# Altium project AC_Measurev2_250616.PrjPcb
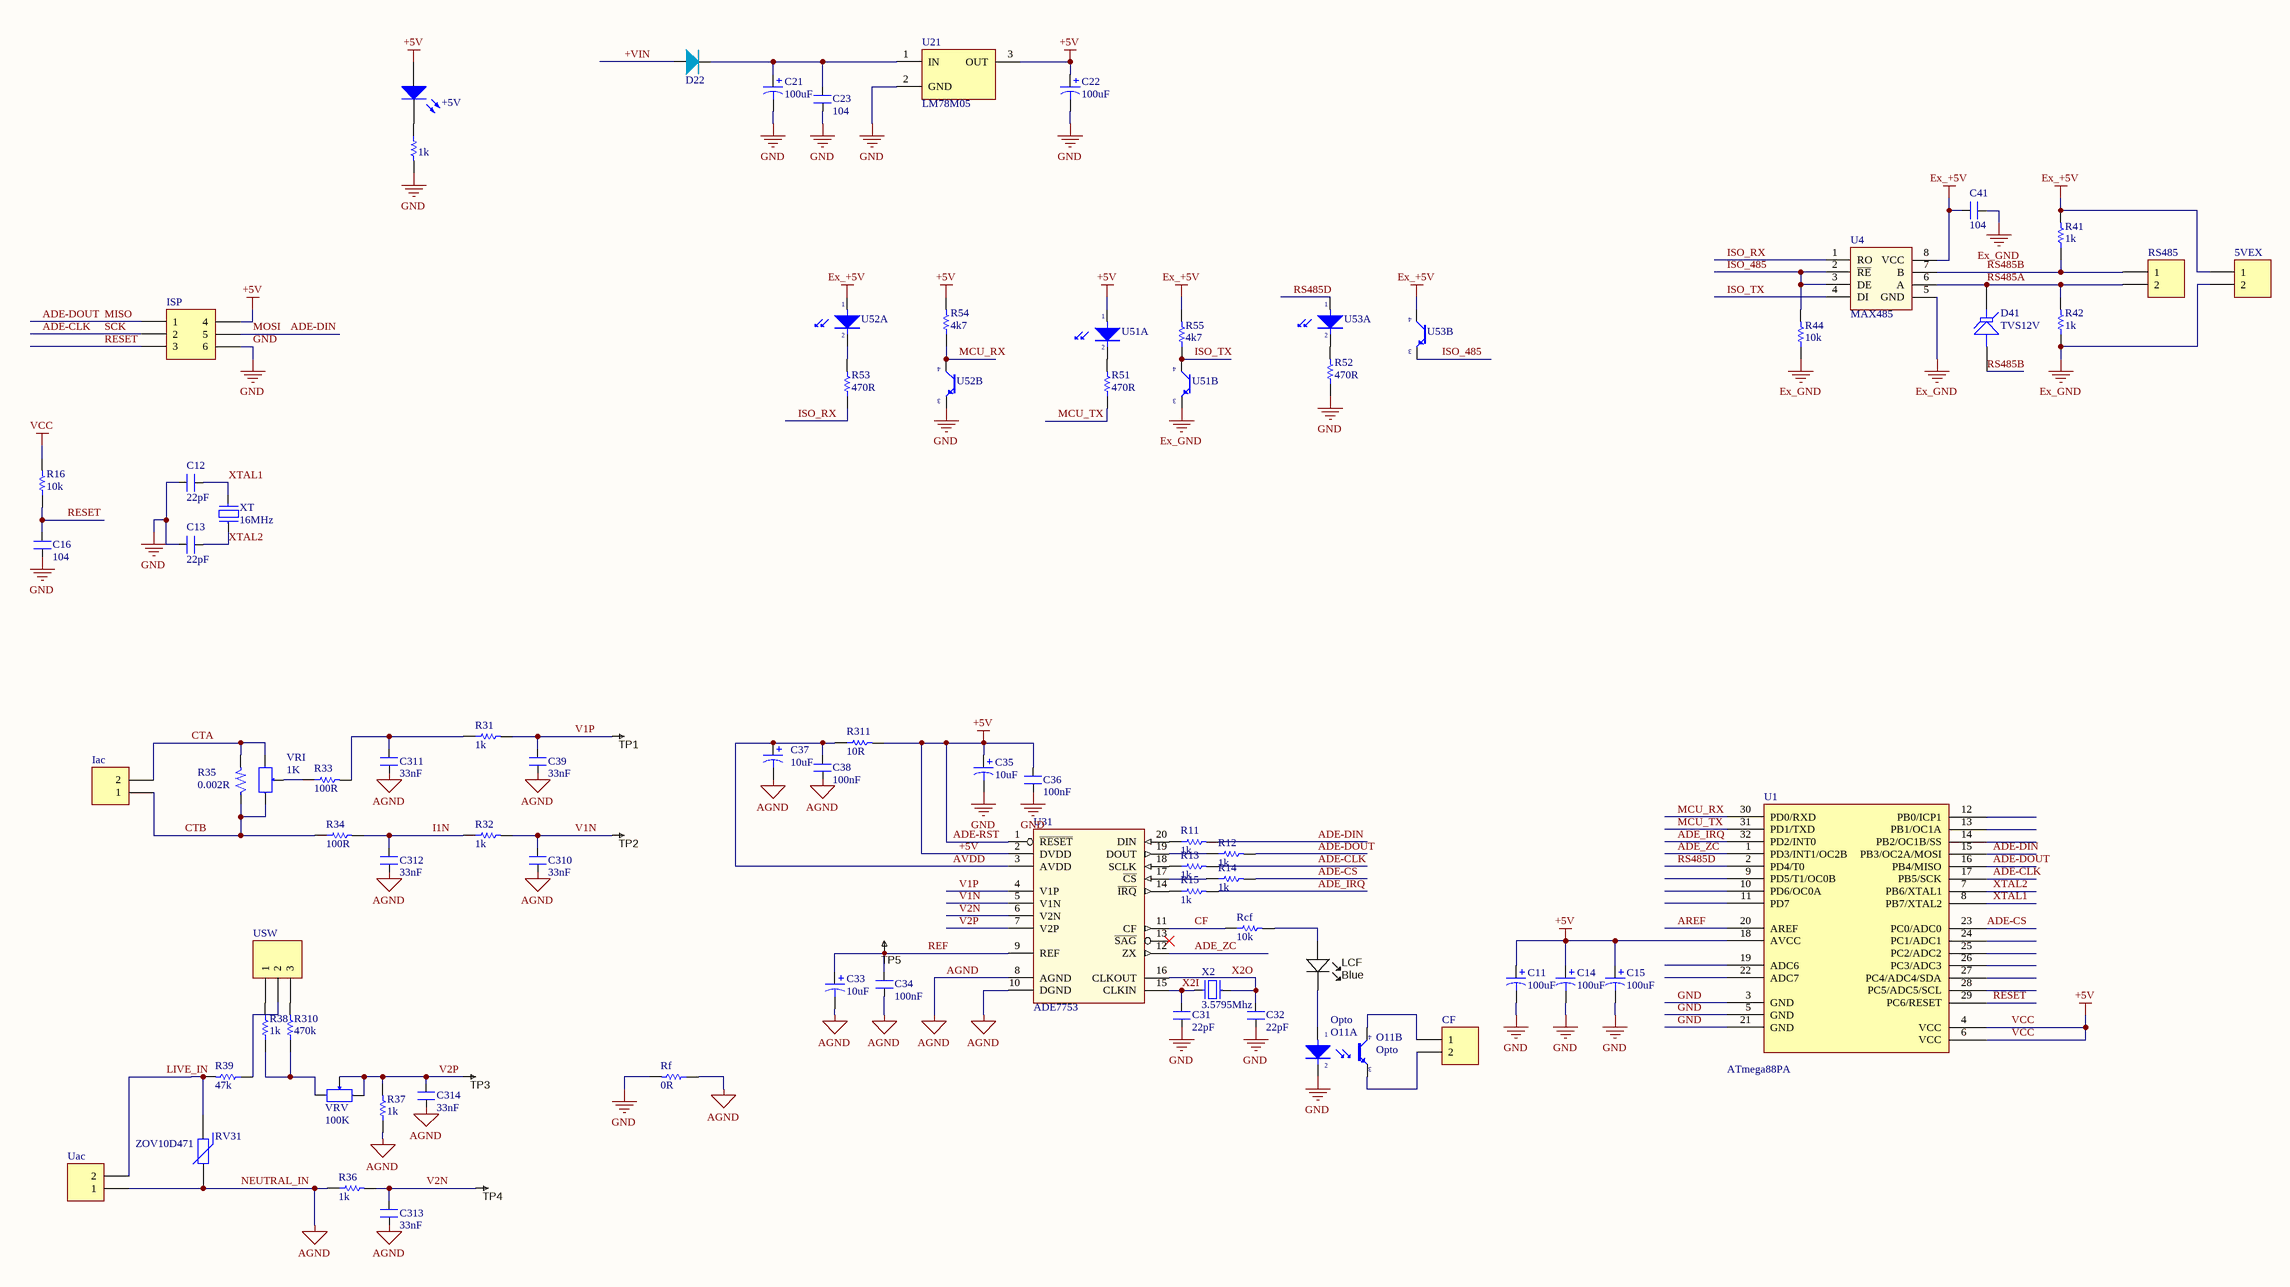
[diagram p0: AC_Measurev2_250616.SchDoc]
1 sheet, 81 parts. Net scope: global (net labels, ports and power ports of the same name join across sheets).
Board file: AC_Measurev2_250616.PcbDoc

## Sheet AC_Measurev2_250616.SchDoc
size A2

### Parts
5VEX  Header 2  [2P_PCB1]  (value not drawn)
+5V  Led  [LED 5mm RED]  (value not drawn)
C11  value 100uF  [CAPC2012N_F]  (hidden comment: Cap)
C12  value 22pF  [CAPC1608N]  (hidden comment: CAP NP)
C13  value 22pF  [CAPC1608N]  (hidden comment: CAP NP)
C14  value 100uF  [CAPC2012N_F]  (hidden comment: Cap)
C15  value 100uF  [CAPC2012N_F]  (hidden comment: Cap)
C16  value 104  [CAPC1608N]  (hidden comment: CAP NP)
C21  value 100uF  [CAP 3.8mm]  (hidden comment: Cap)
C22  value 100uF  [CAP 3.8mm]  (hidden comment: Cap)
C23  value 104  [SMD 1206]  (hidden comment: CAP NP)
C31  value 22pF  [CAPC1608N]  (hidden comment: CAP NP)
C32  value 22pF  [CAPC1608N]  (hidden comment: CAP NP)
C33  value 10uF  [CAPC2012N_F]  (hidden comment: Cap)
C34  value 100nF  [CAPC1608N]  (hidden comment: CAP NP)
C35  value 10uF  [CAPC2012N_F]  (hidden comment: Cap)
C36  value 100nF  [CAPC1608N]  (hidden comment: CAP NP)
C37  value 10uF  [CAPC2012N_F]  (hidden comment: Cap)
C38  value 100nF  [CAPC1608N]  (hidden comment: CAP NP)
C39  value 33nF  [CAPC1608N]  (hidden comment: CAP NP)
C41  value 104  [CAPC2012N_F]  (hidden comment: 100nF/104)
C310  value 33nF  [CAPC1608N]  (hidden comment: CAP NP)
C311  value 33nF  [CAPC1608N]  (hidden comment: CAP NP)
C312  value 33nF  [CAPC1608N]  (hidden comment: CAP NP)
C313  value 33nF  [CAPC2012N_F]  (hidden comment: CAP NP)
C314  value 33nF  [CAPC2012N_F]  (hidden comment: CAP NP)
CF  Header 2  [2P_PCB1]  (value not drawn)
D22  Diode  [DO-214AC]  (value not drawn)
D41  TVS12V  [DO-214AA]
Iac  Header 2  [2P_PCB1]  (value not drawn)
ISP  Header 3X2A  [HDR2X3_CEN]  (value not drawn)
LCF  Blue  [LED-0805-K]
O11  Opto  [DIP4/W0.3]  (parts A,B of 2)
R11  value 1k  [RESC1608N_F]  (hidden comment: Res)
R12  value 1k  [RESC1608N_F]  (hidden comment: Res)
R13  value 1k  [RESC1608N_F]  (hidden comment: Res)
R14  value 1k  [RESC1608N_F]  (hidden comment: Res)
R15  value 1k  [RESC1608N_F]  (hidden comment: Res)
R16  value 10k  [RESC1608N_F]  (hidden comment: Res)
R22  value 1k  [RESC2012N_F]  (hidden comment: Res_0805_1k)
R31  value 1k  [0603ESDA]  (hidden comment: Res)
R32  value 1k  [0603ESDA]  (hidden comment: Res)
R33  value 100R  [0603ESDA]  (hidden comment: Res)
R34  value 100R  [0603ESDA]  (hidden comment: Res)
R35  0.002R  [RESC6332N]
R36  value 1k  [RESC2012N_F]  (hidden comment: Res)
R37  value 1k  [RESC2012N_F]  (hidden comment: Res)
R38  value 1k  [RESC2012N_F]  (hidden comment: Res)
R39  value 47k  [RESC2012N_F]  (hidden comment: Res)
R41  1k  [RESC1608N_ZERO]
R42  1k  [RESC1608N_ZERO]
R44  value 10k  [RESC1608N_ZERO]  (hidden comment: 330R)
R51  value 470R  [RESC2012N_F]  (hidden comment: Res)
R52  value 470R  [RESC2012N_F]  (hidden comment: Res)
R53  value 470R  [RESC2012N_F]  (hidden comment: Res)
R54  value 4k7  [RESC2012N_F]  (hidden comment: Res)
R55  value 4k7  [RESC2012N_F]  (hidden comment: Res)
R310  value 470k  [RESC2012N_F]  (hidden comment: Res)
R311  value 10R  [RESC2012N_F]  (hidden comment: Res)
Rcf  value 10k  [RESC1608N_F]  (hidden comment: Res)
Rf  value 0R  [RESC2012N_F]  (hidden comment: Res)
RS485  Header 2  [2P_PCB1]  (value not drawn)
RV31  ZOV10D471  [CN3]
TP1  TESTPOINT  [TP-R60]  (value not drawn)  (no BOM)
TP2  TESTPOINT  [TP-R60]  (value not drawn)  (no BOM)
TP3  TESTPOINT  [TP-R60]  (value not drawn)  (no BOM)
TP4  TESTPOINT  [TP-R60]  (value not drawn)  (no BOM)
TP5  TESTPOINT  [TP-R60]  (value not drawn)  (no BOM)
U1  ATmega88PA  [32PIN]
U4  MAX485  [SO-8]
U21  LM78M05  [TO252 D-PAK]
U31  ADE7753  [TSSOP-20]
U51  Opto  [DIP4/W0.3]  (value not drawn)  (parts A,B of 2)
U52  Opto  [DIP4/W0.3]  (value not drawn)  (parts A,B of 2)
U53  Opto  [DIP4/W0.3]  (value not drawn)  (parts A,B of 2)
Uac  Header 2  [2P_PCB1]  (value not drawn)
USW  Header 3  [HDR1X3]  (value not drawn)
VRI  1K  [VR1]
VRV  100K  [VR1]
X2  3.5795Mhz  [XT2]
XT  16MHz  [XT2]

### Nets
+5V: +5V.1(A) C11.1 C14.1 C15.1 C22.1 C35.1 C36.2 ISP.4 R16.2 R54.2 R311.2 U1.4(VCC) U1.6(VCC) U1.18(AVCC) U21.3(OUT) U31.1(~{RESET}) U31.2(DVDD) U51.1(A)  [also labelled ADE-RST, VCC]
AGND: C33.2 C34.1 C37.2 C38.1 C39.1 C310.1 C311.1 C312.1 C313.1 C314.1 R36.1 R37.1 Rf.1 RV31.2 U31.8(AGND) U31.10(DGND) Uac.1  [also labelled NEUTRAL_IN]
Ex_+5V: 5VEX.1 C41.2 R41.2 R55.2 U4.8(VCC) U52.1(A) U53.4(C)
Ex_GND: 5VEX.2 C41.1 R42.1 R44.1 U4.5(GND) U51.3(E)
GND: C11.2 C12.2 C13.2 C14.2 C15.2 C16.1 C21.2 C22.2 C23.1 C31.1 C32.1 C35.2 C36.1 ISP.6 O11.2(K) R22.2 R52.1 Rf.2 U1.3(GND) U1.5(GND) U1.21(GND) U21.2(GND) U52.3(E)
+VIN: D22.1(A)
ADE-CLK: ISP.2 R13.2 U1.17(PB5/SCK)  [also labelled SCK]
ADE-CS: R14.2 U1.23(PC0/ADC0)
ADE-DIN: ISP.5 R11.2 U1.15(PB3/OC2A/MOSI)  [also labelled MOSI]
ADE-DOUT: ISP.1 R12.2 U1.16(PB4/MISO)  [also labelled MISO]
ADE_IRQ: R15.2 U1.32(PD2/INT0)
ADE_ZC: U1.1(PD3/INT1/OC2B) U31.12(ZX)
AREF: U1.20(AREF)
AVDD: C37.1 C38.2 R311.1 U31.3(AVDD)
CF: Rcf.1 U31.11(CF)
CTA: Iac.2 R35.2 VRI.1
CTB: Iac.1 R34.1 R35.1 VRI.3
I1N: C312.2 R32.1 R34.2
ISO_485: R44.2 U4.2(~{RE}) U4.3(DE) U53.3(E)
ISO_RX: R53.1 U4.1(RO)
ISO_TX: R55.1 U4.4(DI) U51.4(C)
LIVE_IN: R39.2 RV31.1 Uac.2
MCU_RX: R54.1 U1.30(PD0/RXD) U52.4(C)
MCU_TX: R51.1 U1.31(PD1/TXD)
REF: C33.1 C34.2 TP5.1 U31.9(REF)
RESET: C16.2 ISP.3 R16.1 U1.29(PC6/RESET)
RS485A: D41.2(K) R42.2 RS485.2 U4.6(A)
RS485B: D41.1(A) R41.1 RS485.1 U4.7(B)
RS485D: U1.2(PD4/T0) U53.1(A)
V1N: C310.2 R32.2 TP2.1 U31.5(V1N)
V1P: C39.2 R31.2 TP1.1 U31.4(V1P)
V2N: C313.2 R36.2 TP4.1 U31.6(V2N)
V2P: C314.2 R37.2 TP3.1 U31.7(V2P) VRV.2 VRV.3
X2I: C31.2 U31.15(CLKIN) X2.2
X2O: C32.2 U31.16(CLKOUT) X2.1
XTAL1: C12.1 U1.8(PB7/XTAL2) XT.2
XTAL2: C13.1 U1.7(PB6/XTAL1) XT.1
Net+5V_2: +5V.2(K) R22.1
NetC21_1: C21.1 C23.2 D22.2(K) U21.1(IN)
NetC311_2: C311.2 R31.1 R33.2
NetCF_1: CF.1 O11.4(C)
NetCF_2: CF.2 O11.3(E)
NetLCF_A: LCF.A Rcf.2
NetLCF_K: LCF.K O11.1(A)
NetR11_1: R11.1 U31.20(DIN)
NetR12_1: R12.1 U31.19(DOUT)
NetR13_1: R13.1 U31.18(SCLK)
NetR14_1: R14.1 U31.17(~{CS})
NetR15_1: R15.1 U31.14(~{IRQ})
NetR33_1: R33.1 VRI.2
NetR38_1: R38.1 R310.1 VRV.1
NetR38_2: R38.2 USW.1
NetR39_1: R39.1 USW.2
NetR51_2: R51.2 U51.2(K)
NetR52_2: R52.2 U53.2(K)
NetR53_2: R53.2 U52.2(K)
NetR310_2: R310.2 USW.3

Not connected (* = marked no-connect by the designer): U1 9(PD5/T1/OC0B) 10(PD6/OC0A) 11(PD7) 12(PB0/ICP1) 13(PB1/OC1A) 14(PB2/OC1B/SS) 19(ADC6) 22(ADC7) 24(PC1/ADC1) 25(PC2/ADC2) 26(PC3/ADC3) 27(PC4/ADC4/SDA) 28(PC5/ADC5/SCL); U31 13(~{SAG})*

### Library data of the parts
5VEX CF Iac RS485 Uac = Header 2: Header, 2-Pin; LatestRevisionDate: 17-Jul-2002; LatestRevisionNote: Re-released for DXP Platform.; Publisher: Altium Limited
+5V = Led: pin to pad: 1>A 2>K
C41 = CAP NP
D22 = Diode: pin to pad: 1>A 2>K
D41 = Tranzorb: Transient Voltage Suppression (TVS) Diode; pin to pad: 1>A 2>K; Published: 24-Mar-1999; LatestRevisionDate: 17-Jul-2002; LatestRevisionNote: Re-released for DXP Platform.; PackageReference: DO-7; Publisher: Altium Limited; PackageDescription: Axial Lead Diode
ISP = Header 3X2A: Header, 3-Pin, Dual row; LatestRevisionDate: 17-Jul-2002; LatestRevisionNote: Re-released for DXP Platform.; Publisher: Altium Limited
LCF = LED_SMD_Blue_0805_100mcd: LED 0805 SMD Blue 100mcd 470nm; Manufacturer 1: Ligitek; Manufacturer Part Number 1: LG-170DBKZ-CT; Ratings: 100 mcd; 470 nm; Package / Case: 0805; Material: InGaN/GaN; Value: Blue; Color: Blue
R22 = Res
R35 = R: Resistor 1/4W; Value: 2512/1W/1%
R41 R42 R44 = Res: Tro dan
  R41 R42: Value: 1k
RV31 = Res Varistor: Varistor (Voltage-Sensitive Resistor); Published: 24-Mar-1999; LatestRevisionDate: 29-May-2009; LatestRevisionNote: IPC-7351 Footprint Added.; PackageVersion: Mar-2003; PackageReference: 6-0805; Publisher: Altium Limited; PackageDescription: Chip Resistor 0805 Case Size; Code_IPC: RESC2012
TP1-TP5 = TESTPOINT: SMD test pin
U1 = ATmega48/168/328
U4 = MAX485: RS232 - RS485 (Same sn75176)
U21 = LM78xx
U31 = ADE7753: Single-Phase Multifunction Metering IC with di/dt Sensor Interface
USW = Header 3: Header, 3-Pin; LatestRevisionDate: 17-Jul-2002; LatestRevisionNote: Re-released for DXP Platform.; Publisher: Altium Limited
VRI VRV = VR: Var Resistor; Value: VR 10K
X2 = XT2: Crystal For all Crystal 2pin.; Value: 4Mhz
XT = Crystal